# EAGLE design Pi-Can-Hat (EAGLE 7.4.0)

## Sheet 1 of 2
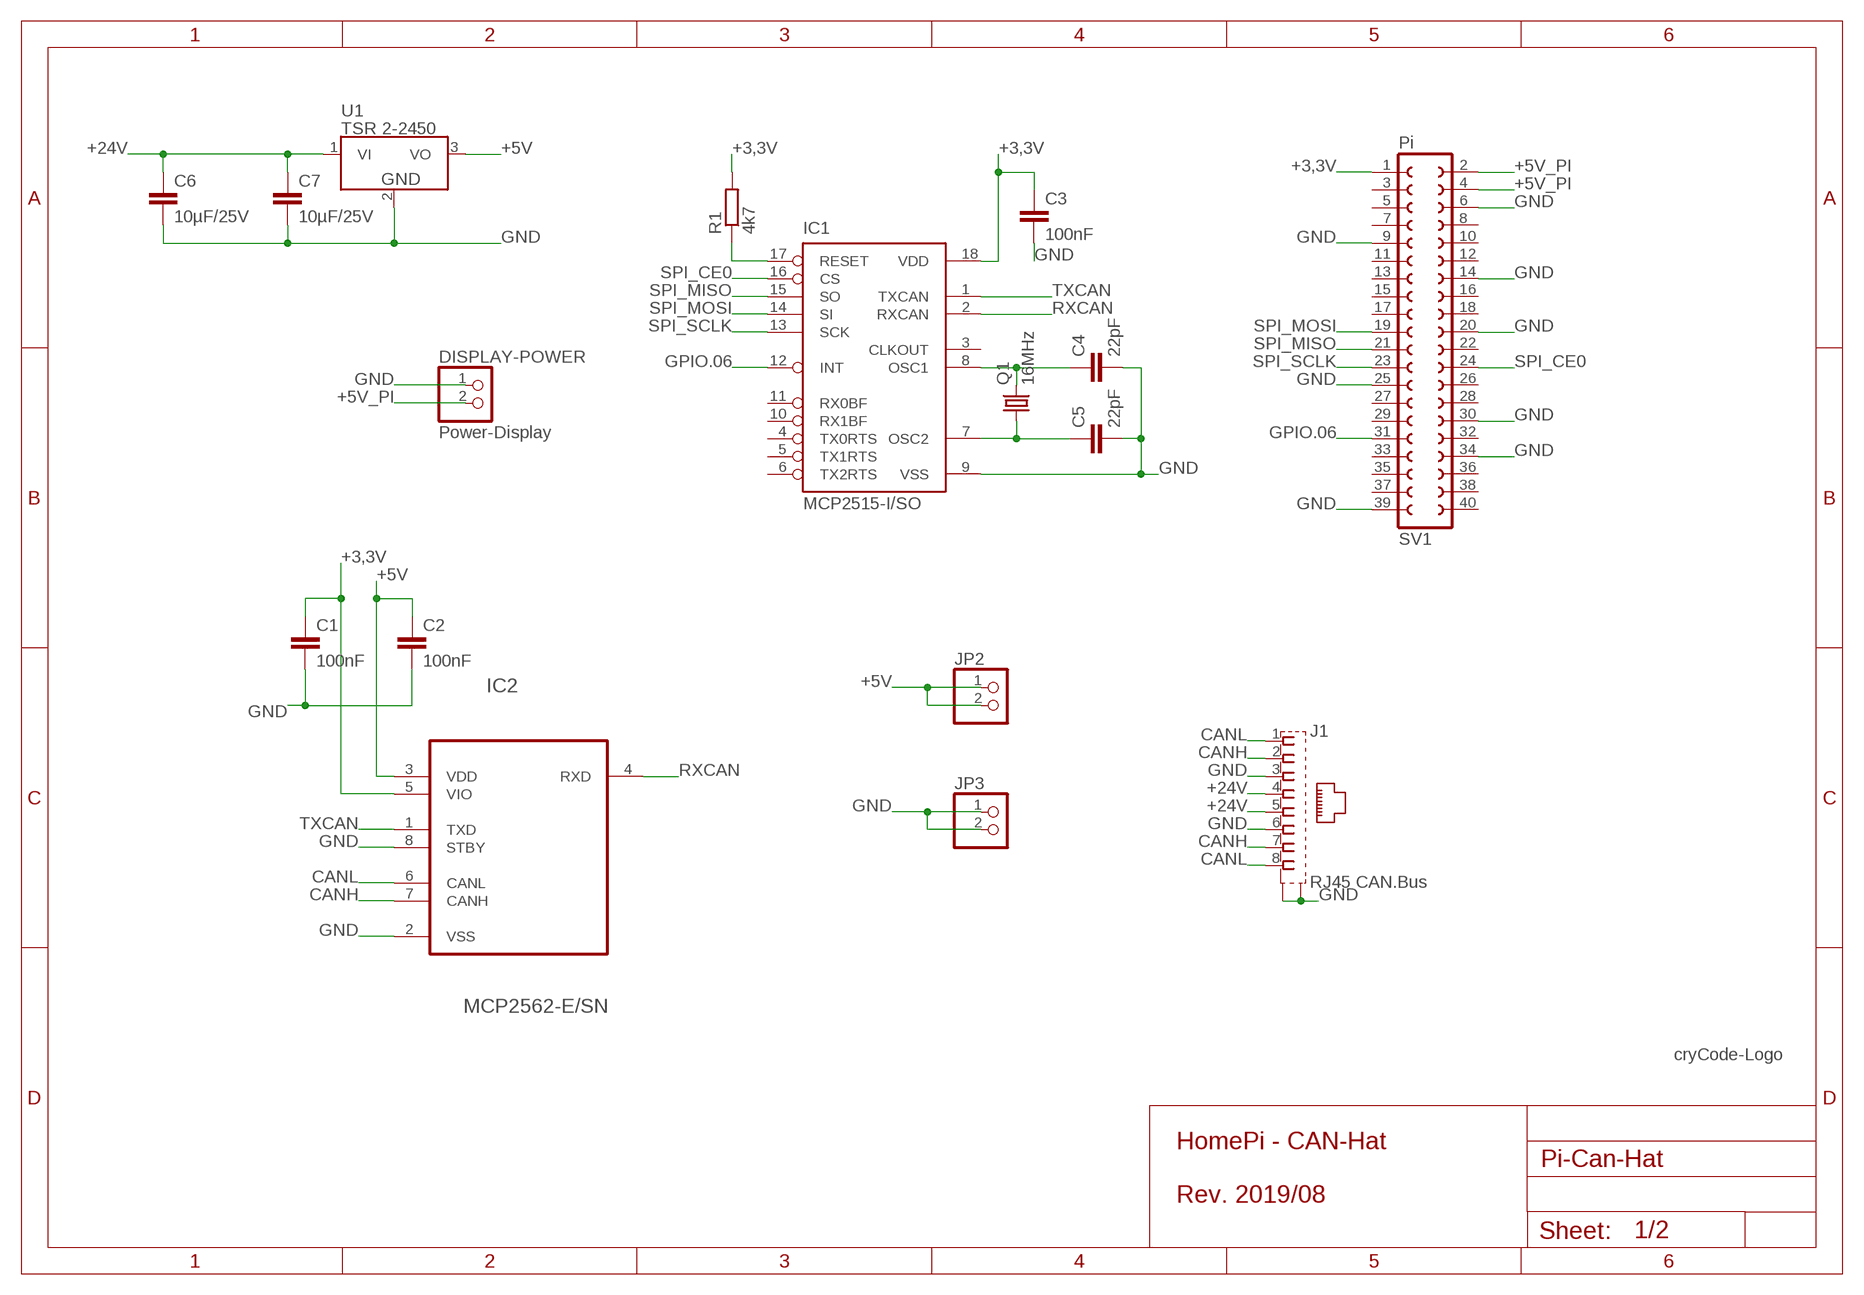
[diagram p0: schematic, sheet 1]

### Parts
C1  100nF  C-EUC1206  [C1206]
C2  100nF  C-EUC1206  [C1206]
C3  100nF  C-EUC1206  [C1206]
C4  22pF  C-EUC1206  [C1206]
C5  22pF  C-EUC1206  [C1206]
C6  10µF/25V  C-EUC1206  [C1206]
C7  10µF/25V  C-EUC1206  [C1206]
DISPLAY-POWER  Power-Display  PINHD-1X2/90  [1X02/90]
IC1  MCP2515-I/SO  [SO18L]
IC2  MCP2562-E/SN  [SO08]
J1  RJ45 CAN.Bus  555141-1  [MEBP_8-8G]
JP2  PINHD-1X2  [1X02]
JP3  PINHD-1X2  [1X02]
Q1  16MHz  CRYSTALHC49UP  [HC49UP]
R1  4k7  R-EU_R1206  [R1206]
SV1  Pi  FE20-2  [FE20-2]
U1  TSR 2-2450  TSR2-2450  [TSR2]
U$1  LOGO30MM  [30MM]

### Nets
+3,3V: C1.1 C3.1 IC1.18(VDD) IC2.5(VIO) R1.2 SV1.1
+5V: C2.1 IC2.3(VDD) JP2.1 JP2.2 U1.3(VO) ; also sheet 2
+5V_PI: DISPLAY-POWER.2 SV1.2 SV1.4 ; also sheet 2
+24V [24V]: C6.1 C7.1 J1.4 J1.5 U1.1(VI)
CANH: IC2.7(CANH) J1.2 J1.7 ; also sheet 2
CANL: IC2.6(CANL) J1.1 J1.8 ; also sheet 2
GND: C1.2 C2.2 C3.2 C4.2 C5.2 C6.2 C7.2 DISPLAY-POWER.1 IC1.9(VSS) IC2.2(VSS) IC2.8(STBY) J1.3 J1.6 J1.G1(S1) J1.G2(S2) JP3.1 JP3.2 SV1.6 SV1.9 SV1.14 SV1.20 SV1.25 SV1.30 SV1.34 SV1.39 U1.2(GND) ; also sheet 2
GPIO.06: IC1.12(INT) SV1.31
N$1: C4.1 IC1.8(OSC1) Q1.2
N$2: IC1.17(RESET) R1.1
N$4: C5.1 IC1.7(OSC2) Q1.1
RXCAN: IC1.2(RXCAN) IC2.4(RXD)
SPI_CE0: IC1.16(CS) SV1.24
SPI_MISO: IC1.15(SO) SV1.21
SPI_MOSI: IC1.14(SI) SV1.19
SPI_SCLK: IC1.13(SCK) SV1.23
TXCAN: IC1.1(TXCAN) IC2.1(TXD)
Unconnected: IC1.3(CLKOUT) IC1.4(TX0RTS) IC1.5(TX1RTS) IC1.6(TX2RTS) IC1.10(RX1BF) IC1.11(RX0BF) SV1.3 SV1.5 SV1.7 SV1.8 SV1.10 SV1.11 SV1.12 SV1.13 SV1.15 SV1.16 SV1.17 SV1.18 SV1.22 SV1.26 SV1.27 SV1.28 SV1.29 SV1.32 SV1.33 SV1.35 SV1.36 SV1.37 SV1.38 SV1.40

### Notes on the sheet
- HomePi - CAN-Hat
  
  Rev. 2019/08

## Sheet 2 of 2
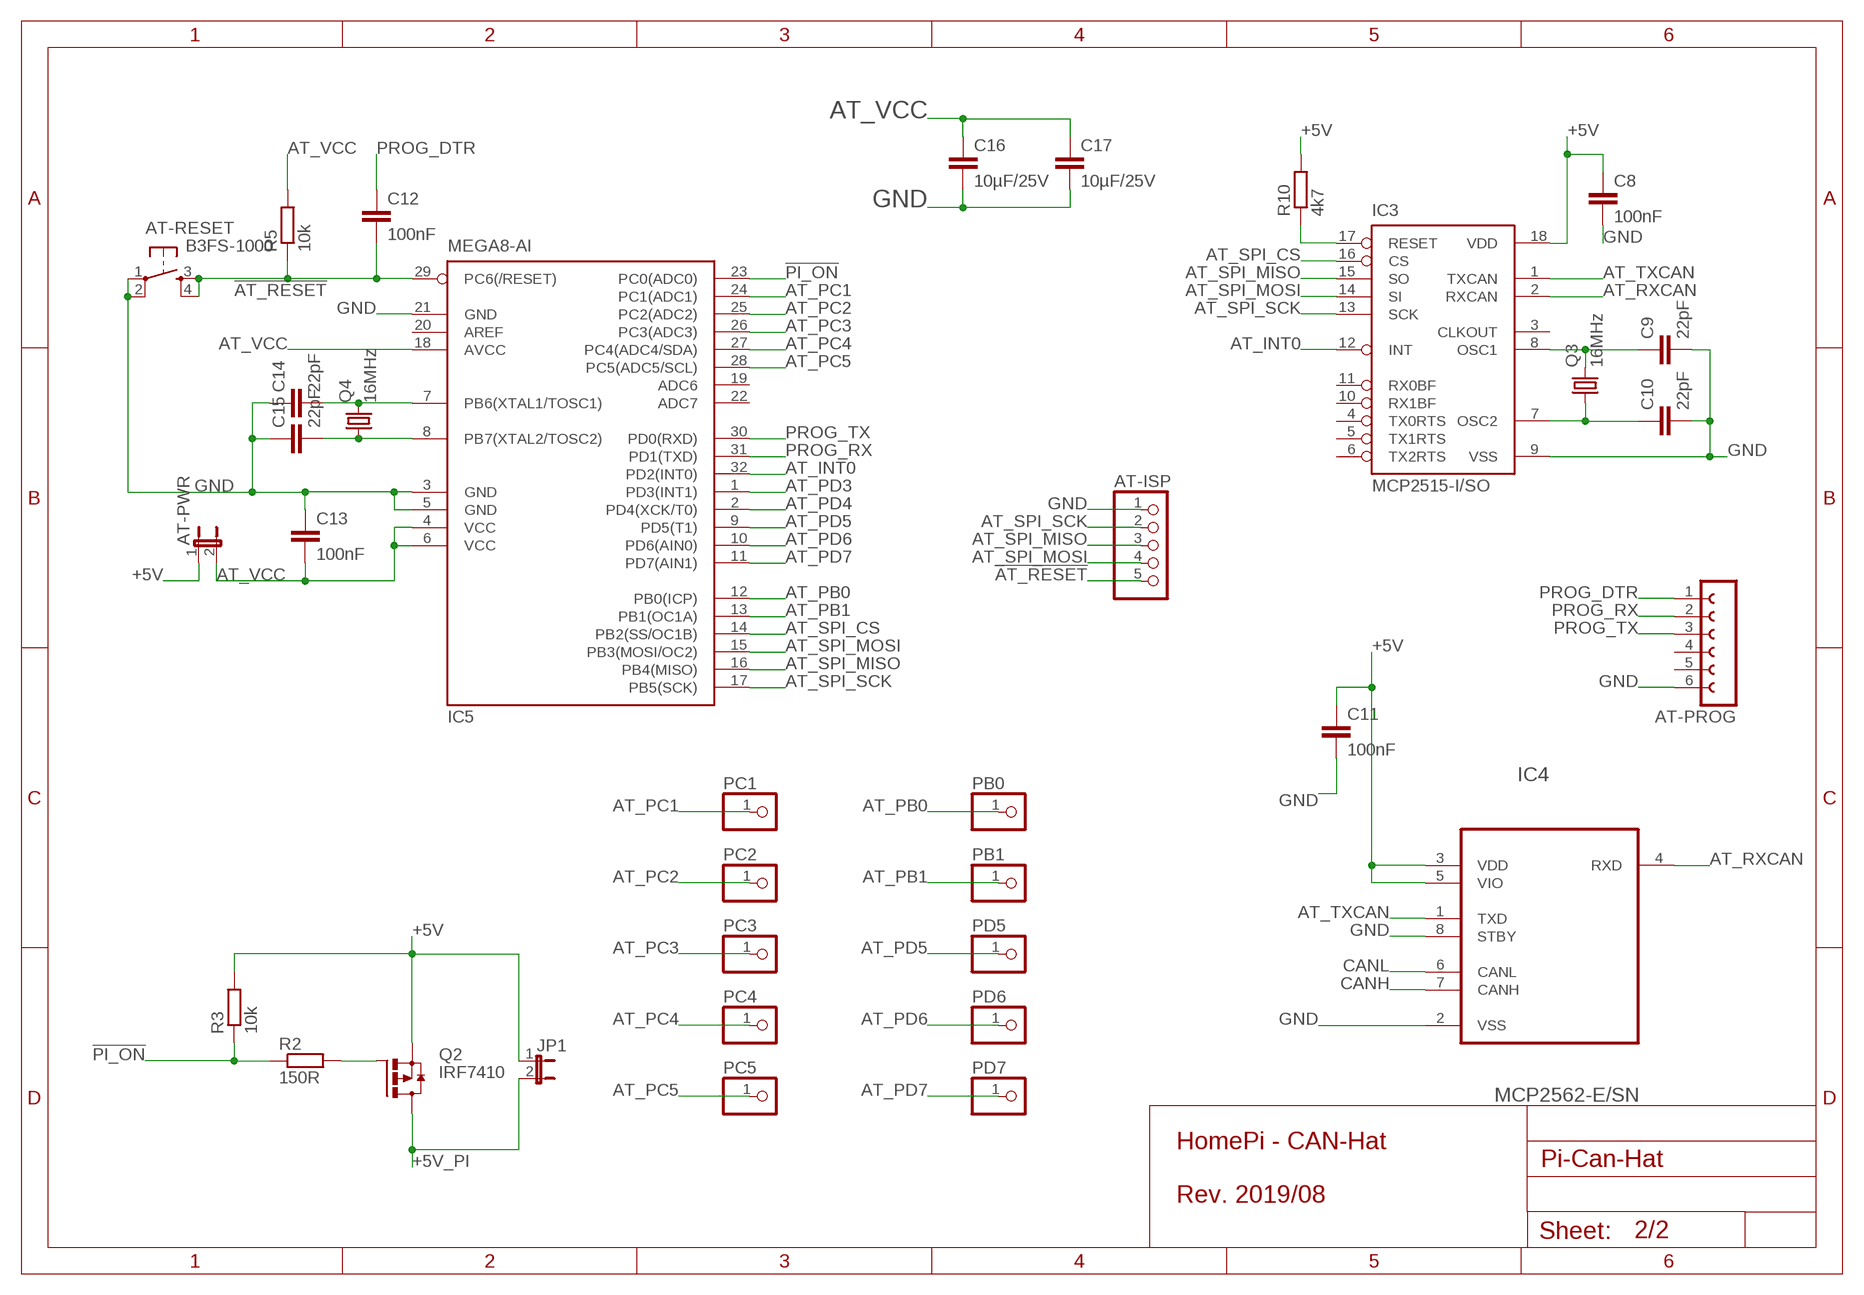
[diagram p1: schematic, sheet 2]

### Parts
AT-ISP  PINHD-1X5  [1X05]
AT-PROG  FE06W  [FE06W]
AT-PWR  JP1E  [JP1]
AT-RESET  B3FS-1000  [B3FS-1000]
C8  100nF  C-EUC1206  [C1206]
C9  22pF  C-EUC1206  [C1206]
C10  22pF  C-EUC1206  [C1206]
C11  100nF  C-EUC1206  [C1206]
C12  100nF  C-EUC1206  [C1206]
C13  100nF  C-EUC1206  [C1206]
C14  22pF  C-EUC1206  [C1206]
C15  22pF  C-EUC1206  [C1206]
C16  10µF/25V  C-EUC1206  [C1206]
C17  10µF/25V  C-EUC1206  [C1206]
IC3  MCP2515-I/SO  [SO18L]
IC4  MCP2562-E/SN  [SO08]
IC5  MEGA8-AI  [TQFP32-08]
JP1  JP1E  [JP1]
PB0  PINHD-1X1  [1X01]
PB1  PINHD-1X1  [1X01]
PC1  PINHD-1X1  [1X01]
PC2  PINHD-1X1  [1X01]
PC3  PINHD-1X1  [1X01]
PC4  PINHD-1X1  [1X01]
PC5  PINHD-1X1  [1X01]
PD5  PINHD-1X1  [1X01]
PD6  PINHD-1X1  [1X01]
PD7  PINHD-1X1  [1X01]
Q2  IRF7410  [SO08]
Q3  16MHz  CRYSTALHC49UP  [HC49UP]
Q4  16MHz  CRYSTALHC49UP  [HC49UP]
R2  150R  R-EU_R1206  [R1206]
R3  10k  R-EU_R1206  [R1206]
R5  10k  R-EU_R1206  [R1206]
R10  4k7  R-EU_R1206  [R1206]

### Nets
!AT_RESET: AT-ISP.5 AT-RESET.3(S) AT-RESET.4(S1) C12.2 IC5.29(PC6(/RESET)) R5.1
!PI_ON: IC5.23(PC0(ADC0)) R2.1 R3.1
+5V: AT-PWR.1 C8.1 C11.1 IC3.18(VDD) IC4.3(VDD) IC4.5(VIO) JP1.1 Q2.1(S) Q2.2(S) Q2.3(S) R3.2 R10.2 ; also sheet 1
+5V_PI: JP1.2 Q2.5(D) Q2.6(D) Q2.7(D) Q2.8(D) ; also sheet 1
AT_INT0: IC3.12(INT) IC5.32(PD2(INT0))
AT_PB0: IC5.12(PB0(ICP)) PB0.1
AT_PB1: IC5.13(PB1(OC1A)) PB1.1
AT_PC1: IC5.24(PC1(ADC1)) PC1.1
AT_PC2: IC5.25(PC2(ADC2)) PC2.1
AT_PC3: IC5.26(PC3(ADC3)) PC3.1
AT_PC4: IC5.27(PC4(ADC4/SDA)) PC4.1
AT_PC5: IC5.28(PC5(ADC5/SCL)) PC5.1
AT_PD3: IC5.1(PD3(INT1))
AT_PD4: IC5.2(PD4(XCK/T0))
AT_PD5: IC5.9(PD5(T1)) PD5.1
AT_PD6: IC5.10(PD6(AIN0)) PD6.1
AT_PD7: IC5.11(PD7(AIN1)) PD7.1
AT_RXCAN: IC3.2(RXCAN) IC4.4(RXD)
AT_SPI_CS: IC3.16(CS) IC5.14(PB2(SS/OC1B))
AT_SPI_MISO: AT-ISP.3 IC3.15(SO) IC5.16(PB4(MISO))
AT_SPI_MOSI: AT-ISP.4 IC3.14(SI) IC5.15(PB3(MOSI/OC2))
AT_SPI_SCK: AT-ISP.2 IC3.13(SCK) IC5.17(PB5(SCK))
AT_TXCAN: IC3.1(TXCAN) IC4.1(TXD)
AT_VCC: AT-PWR.2 C13.2 C16.1 C17.1 IC5.4(VCC) IC5.6(VCC) IC5.18(AVCC) R5.2
CANH: IC4.7(CANH) ; also sheet 1
CANL: IC4.6(CANL) ; also sheet 1
GND: AT-ISP.1 AT-PROG.6 AT-RESET.1(P) AT-RESET.2(P1) C8.2 C9.2 C10.2 C11.2 C13.1 C14.1 C15.1 C16.2 C17.2 IC3.9(VSS) IC4.2(VSS) IC4.8(STBY) IC5.3(GND) IC5.5(GND) IC5.21(GND) ; also sheet 1
N$5: Q2.4(G) R2.2
N$6: IC3.17(RESET) R10.1
N$7: C9.1 IC3.8(OSC1) Q3.2
N$8: C10.1 IC3.7(OSC2) Q3.1
N$10: C14.2 IC5.7(PB6(XTAL1/TOSC1)) Q4.2
N$11: C15.2 IC5.8(PB7(XTAL2/TOSC2)) Q4.1
PROG_DTR: AT-PROG.1 C12.1
PROG_RX: AT-PROG.2 IC5.31(PD1(TXD))
PROG_TX: AT-PROG.3 IC5.30(PD0(RXD))
Unconnected: AT-PROG.4 AT-PROG.5 IC3.3(CLKOUT) IC3.4(TX0RTS) IC3.5(TX1RTS) IC3.6(TX2RTS) IC3.10(RX1BF) IC3.11(RX0BF) IC5.19(ADC6) IC5.20(AREF) IC5.22(ADC7)

### Notes on the sheet
- HomePi - CAN-Hat
  
  Rev. 2019/08

## Library data of the parts
AT-ISP = pinhead:PINHD-1X5: PIN HEADER
AT-PROG = con-lsta:FE06W: FEMALE HEADER; OC_FARNELL: unknown; OC_NEWARK: unknown
AT-PWR JP1 = jumper:JP1E: JUMPER
AT-RESET = b3fs-1000:B3FS-1000
C1-C17 = rcl:C-EU: CAPACITOR, European symbol
DISPLAY-POWER JP2 JP3 = pinhead:PINHD-1X2: PIN HEADER
IC1 IC3 = mcp2515_2551_2562:MCP2515
IC2 IC4 = mcp2515_2551_2562:MCP2562: High-Speed CAN Transceiver,DIP-8
IC5 = atmel:MEGA8: MICROCONTROLLER 8 Kbytes FLASH, 1 kbytes SRAM, 512 bytes EEPROM, USART, 6-channel 10 bit ADC, 2-channel 8 bit ADC Pin compatible with Atmega48, ATMega88, ATMega168 Source: avr.lbr; MPN: ATMEGA8-16AU; OC_FARNELL: 9171371; OC_NEWARK: 73M8863
J1 = mebp_8-8g:555141-1: AMP connector Reichelt Bestell-Nr. MEBP 8-8G
PB0 PB1 PC1-PC5 PD5-PD7 = pinhead:PINHD-1X1: PIN HEADER
Q1 Q3 Q4 = crystal:CRYSTAL: CRYSTAL; OC_FARNELL: unknown; OC_NEWARK: unknown
Q2 = IRF74:IRF7410: HEXFET Power MOSFET P-Channel MOSFET VDS = -12V ID@25°C = -16A ID@70°C = -13A RDS@VGS=-4.5V,ID=-16A = 0.007 Ohm RDS@VGS=-2.5V,ID=-13.6A = 0.009 Ohm RDS@VGS=-1.8V,ID=-11.5A = 0.013 Ohm
R1-R3 R5 R10 = rcl:R-EU_: RESISTOR, European symbol
SV1 = con-lsta:FE20-2: FEMALE HEADER; OC_FARNELL: unknown; OC_NEWARK: unknown
U1 = TSR:TSR2-*: TSR 2 Series, 1 A The new TSR 2 series step-down switching regulators are drop-in replacement for inefficient LMxx linear regulators. A high efficiency up to 96 % allows full load operation up to +67°C ambient temperature without the need of any heat-sink or forced cooling.The TSR 2 switching regulators provide other significant features over linear regulators, i.e. better output accuracy (±2 %), lower standby current of 2 mA and no requirement of external capacitors. The high efficiency and low standby power consumption makes these regulators an ideal solution for many battery powered applications.
U$1 = cryCode-Logo:LOGO

## Net classes
1 24V: width 0.813 mm, clearance 0.406 mm

## Board
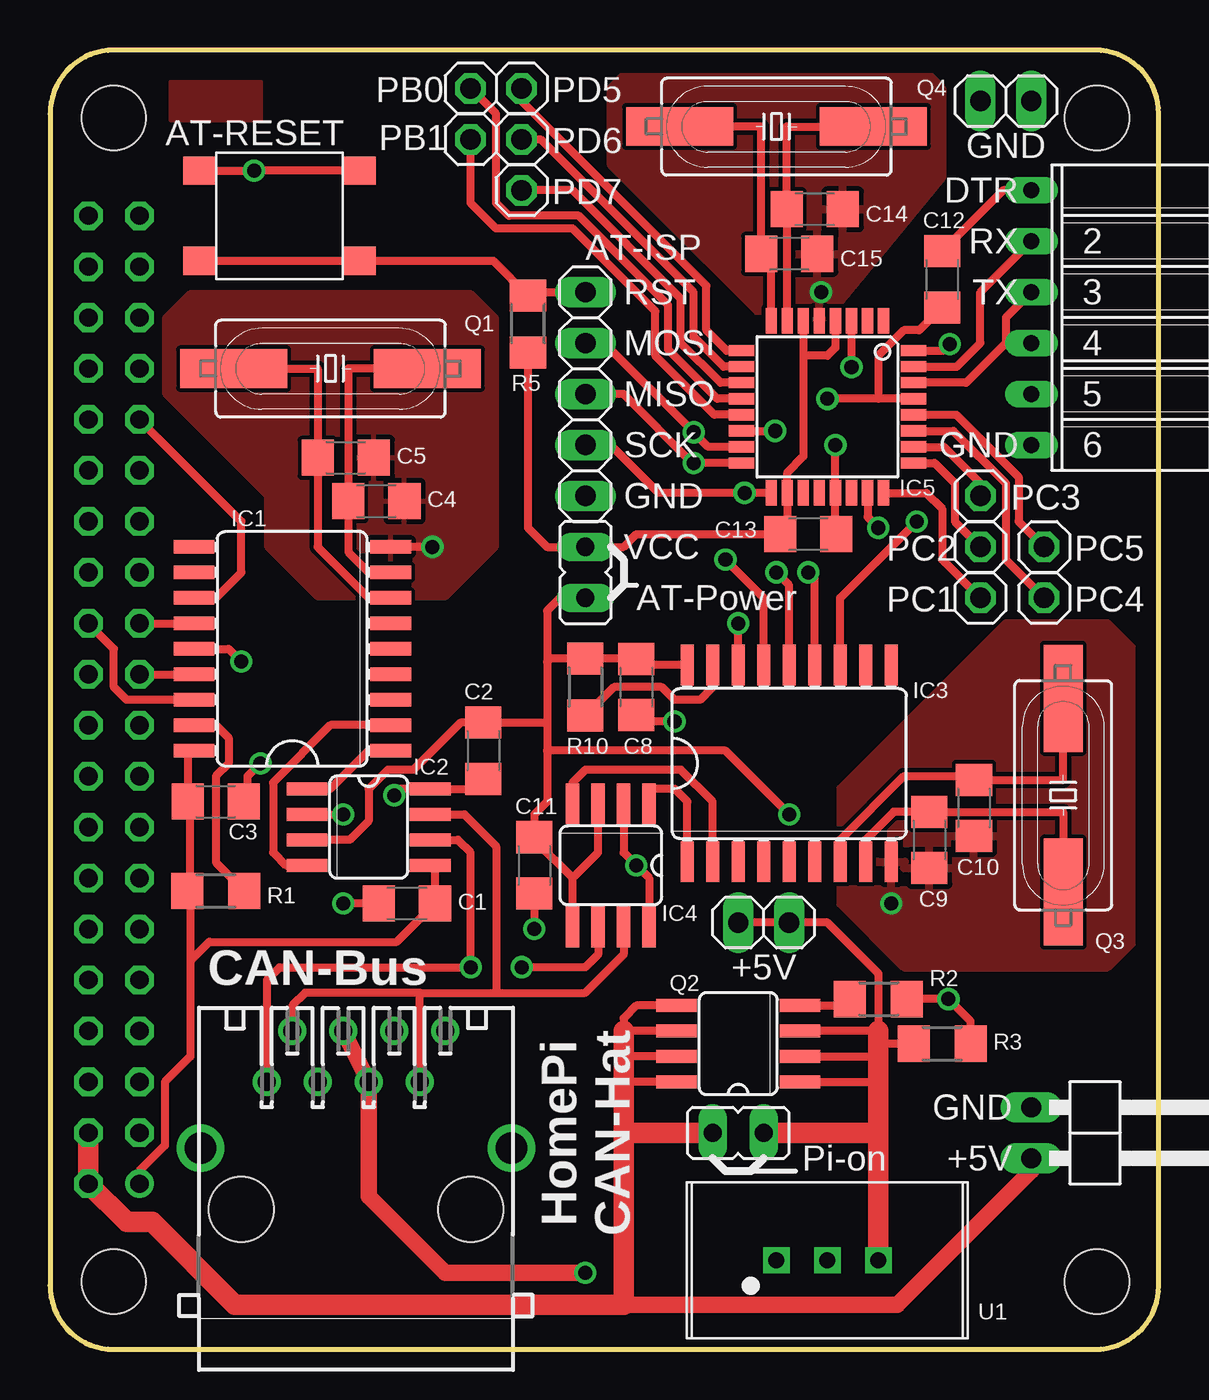
[diagram p2: board, top side]
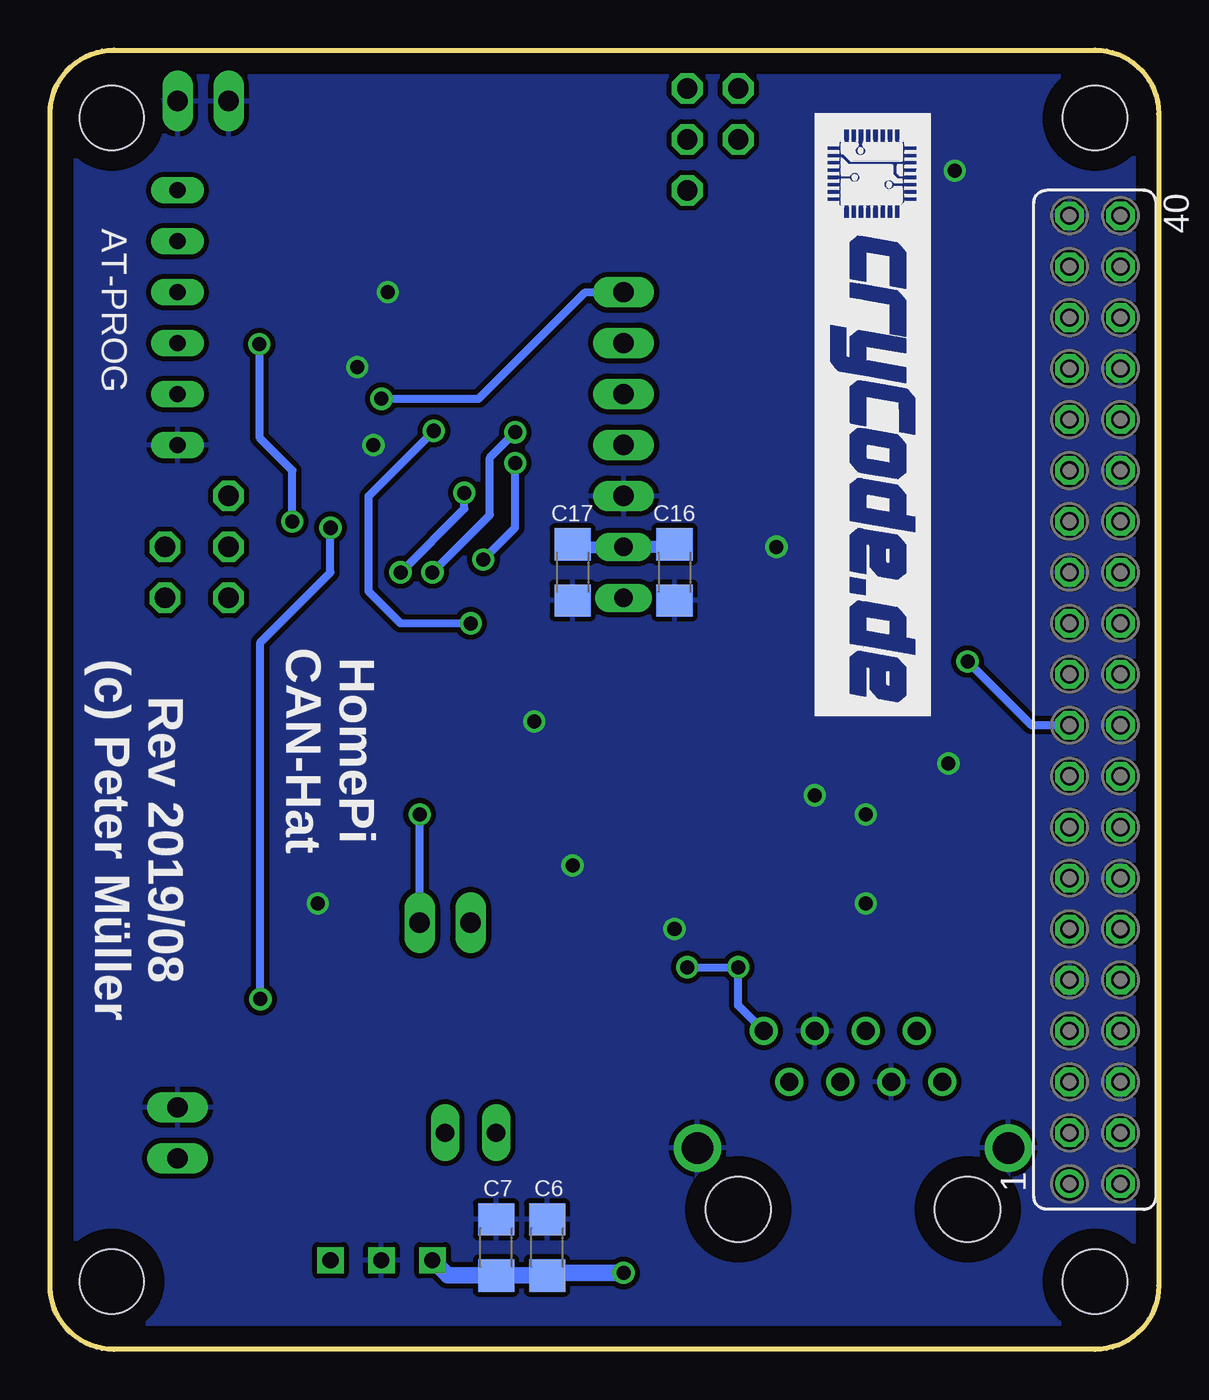
[diagram p3: board, bottom side, seen from below]

Size 55.24 x 64.77 mm. Coordinates in mm from the lower left corner, seen from the top.
Outline: 0,3.17 arc90 3.17,0 52.07,0 arc90 55.24,3.17 55.24,61.59 arc90 52.07,64.77 3.17,64.77 arc90 0,61.59 0,3.17
Copper layers (1*16): Top 0.035mm / dielectric 1.5mm / Bottom 0.035mm
Design rules "allpcb2 *": minimum track width 8mil, minimum drill 0.5mm, track to track 8mil, track to pad 8mil, pad to pad 8mil, via to via 8mil, smd to smd 6mil, copper to edge 40mil, drill to drill 8mil, minimum pad ring 10mil, minimum via ring 8mil, stop-mask expansion 0.1mm, vias tented up to drill 0mil, thermal gap 10mil
Holes 3.2 mm at 3.17,3.38 3.17,61.38 52.17,3.38 52.17,61.38

### Footprints (pad centres in the part's own frame; a part is rotated, then mirrored left to right if it is on the bottom)
1X05 = drill 1.016 long: 1 -5.08,0; 2 -2.54,0; 3 0,0; 4 2.54,0; 5 5.08,0
FE06W = drill 0.813 long: 1 -6.35,0; 2 -3.81,0; 3 -1.27,0; 4 1.27,0; 5 3.81,0; 6 6.35,0
JP1 = drill 0.914 long: 1 0,-1.27; 2 0,1.27
B3FS-1000 = smd 1.6 x 1.4: 1 4,-2.25; 2 -4,-2.25; 3 4,2.25; 4 -4,2.25
C1206 = smd 1.6 x 1.8: 1 -1.4,0; 2 1.4,0
1X02/90 = drill 1.016 long: 1 -1.27,-3.81; 2 1.27,-3.81
SO18L = smd 0.66 x 2.032: 1 -5.08,-4.902; 2 -3.81,-4.902; 3 -2.54,-4.902; 4 -1.27,-4.902; 5 0,-4.902; 6 1.27,-4.902; 7 2.54,-4.902; 8 3.81,-4.902; 9 5.08,-4.902; 10 5.08,4.902; 11 3.81,4.902; 12 2.54,4.902; 13 1.27,4.902; 14 0,4.902; 15 -1.27,4.902; 16 -2.54,4.902; 17 -3.81,4.902; 18 -5.08,4.902
SO08 = smd 0.66 x 2.032: 1 -1.905,-3.073; 2 -0.635,-3.073; 3 0.635,-3.073; 4 1.905,-3.073; 5 1.905,3.073; 6 0.635,3.073; 7 -0.635,3.073; 8 -1.905,3.073
TQFP32-08 = smd 1.27 x 0.559: 1 -4.293,2.8; 2 -4.293,2; 3 -4.293,1.2; 4 -4.293,0.4; 5 -4.293,-0.4; 6 -4.293,-1.2; 7 -4.293,-2; 8 -4.293,-2.8; 17 4.293,-2.8; 18 4.293,-2; 19 4.293,-1.2; 20 4.293,-0.4; 21 4.293,0.4; 22 4.293,1.2; 23 4.293,2; 24 4.293,2.8 | smd 0.559 x 1.27: 9 -2.8,-4.293; 10 -2,-4.293; 11 -1.2,-4.293; 12 -0.4,-4.293; 13 0.4,-4.293; 14 1.2,-4.293; 15 2,-4.293; 16 2.8,-4.293; 25 2.8,4.293; 26 2,4.293; 27 1.2,4.293; 28 0.4,4.293; 29 -0.4,4.293; 30 -1.2,4.293; 31 -2,4.293; 32 -2.8,4.293
MEBP_8-8G = drill 0.889: 1 -4.445,6.35; 2 -3.175,8.89; 3 -1.905,6.35; 4 -0.635,8.89; 5 0.635,6.35; 6 1.905,8.89; 7 3.175,6.35; 8 4.445,8.89 | drill 1.575 pad 2.184: G1 -7.745,3.05; G2 7.745,3.05 | hole 3.251: -5.715,0; 5.715,0
1X02 = drill 1.016 long: 1 -1.27,0; 2 1.27,0
1X01 = drill 1.016 octagon: 1 0,0
HC49UP = smd 5.334 x 1.93: 1 -4.826,0; 2 4.826,0
R1206 = smd 1.6 x 1.803: 1 -1.422,0; 2 1.422,0
FE20-2 = drill 0.914: 1 -24.13,1.27 | drill 0.914 octagon: 2 -24.13,-1.27; 3 -21.59,1.27; 4 -21.59,-1.27; 5 -19.05,1.27; 6 -19.05,-1.27; 7 -16.51,1.27; 8 -16.51,-1.27; 9 -13.97,1.27; 10 -13.97,-1.27; 11 -11.43,1.27; 12 -11.43,-1.27; 13 -8.89,1.27; 14 -8.89,-1.27; 15 -6.35,1.27; 16 -6.35,-1.27; 17 -3.81,1.27; 18 -3.81,-1.27; 19 -1.27,1.27; 20 -1.27,-1.27; 21 1.27,1.27; 22 1.27,-1.27; 23 3.81,1.27; 24 3.81,-1.27; 25 6.35,1.27; 26 6.35,-1.27; 27 8.89,1.27; 28 8.89,-1.27; 29 11.43,1.27; 30 11.43,-1.27; 31 13.97,1.27; 32 13.97,-1.27; 33 16.51,1.27; 34 16.51,-1.27; 35 19.05,1.27; 36 19.05,-1.27; 37 21.59,1.27; 38 21.59,-1.27; 39 24.13,1.27; 40 24.13,-1.27
TSR2 = drill 0.8 square: 1 -2.54,0; 2 0,0; 3 2.54,0

### Placement (x,y rotation side)
AT-ISP  26.67,47.62 90 top
AT-PROG  48.9,51.44 270 top
AT-PWR  26.67,38.73 0 top
AT-RESET  11.43,56.52 180 top
C1  17.78,22.23 180 top
C2  21.59,29.84 270 top
C3  8.26,27.3 0 top
C4  16.26,42.29 0 top
C5  14.73,44.45 0 top
C6  30.48,5.08 90 bottom
C7  33.02,5.08 90 bottom
C8  29.21,33.02 270 top
C9  43.81,25.4 270 top
C10  46.04,26.99 270 top
C11  24.13,24.13 270 top
C12  44.45,53.34 270 top
C13  37.78,40.64 180 top
C14  38.1,56.83 180 top
C15  36.83,54.61 180 top
C16  24.13,38.73 270 bottom
C17  29.21,38.73 270 bottom
DISPLAY-POWER  52.7,10.79 270 top
IC1  12.06,34.92 90 top
IC2  15.88,26.04 270 top
IC3  36.83,29.21 0 top
IC4  27.94,24.13 180 top
IC5  38.73,46.99 270 top
J1  15.24,6.99 0 top
JP1  34.29,10.79 90 top
JP2  35.56,21.27 180 top
JP3  47.62,62.23 0 top
PB0  20.95,62.87 0 top
PB1  20.95,60.33 0 top
PC1  46.35,37.47 0 top
PC2  46.35,40.01 0 top
PC3  46.35,42.55 0 top
PC4  49.53,37.47 0 top
PC5  49.53,40.01 0 top
PD5  23.5,62.87 0 top
PD6  23.5,60.33 0 top
PD7  23.5,57.78 0 top
Q1  13.97,48.9 0 top
Q2  34.29,15.24 90 top
Q3  50.48,27.62 270 top
Q4  36.2,60.96 0 top
R1  8.26,22.86 180 top
R2  41.27,17.46 180 top
R3  44.45,15.24 180 top
R5  23.81,51.12 270 top
R10  26.67,33.02 90 top
SV1  3.17,32.38 90 bottom
U1  38.73,4.45 0 top
U$1  17.14,61.59 270 bottom

### Tracks (layer width: path | path; a pad name or v marks a point on that pad's centre or on a via)
!AT_RESET  (via drill 0.7)
  Top 0.406: IC5.29 41.27,47.39 | 41.27,47.39 v38.73,47.39 | 41.27,47.39 41.27,49.53 42.55,50.8 43.31,50.8 C12.2 | AT-RESET.3 AT-RESET.4 22.09,54.27 R5.1 23.98,52.7 AT-ISP.5
  Bottom 0.406: v38.73,47.39 33.89,47.39 28.57,52.7 AT-ISP.5
!PI_ON  (via drill 0.7)
  Top 0.406: IC5.23 40.73,41.5 v41.27,40.96 | R2.1 v44.77,17.46 45.87,16.36 R3.1
  Bottom 0.406: v44.77,17.46 44.77,35.24 41.27,38.73 v41.27,40.96
+3,3V
  Top 0.406: IC1.18 6.86,29.84 C3.1 6.99,27.3 6.99,23.5 | SV1.1 4.45,8.89 5.71,10.16 5.71,13.34 6.99,14.61 6.99,19.37 | 6.99,23.5 6.99,19.37 | IC2.5 19.18,24.13 C1.1 17.27,20.32 7.94,20.32 6.99,19.37 | 6.99,23.5 R1.2
+5V  (via drill 0.7)
  Top 0.406: Q2.3 41.27,15.88 41.27,18.73 38.73,21.27 JP2.1 JP2.2 | Q2.2 41.27,14.61 | Q2.1 41.27,13.34 | IC4.5 26.04,23.5 | 26.04,23.5 27.3,24.77 IC4.3 | IC3.18 29.54,34.11 C8.1 29.19,34.44 R10.2 24.92,34.44 24.77,34.29 | AT-PWR.1 25.4,37.47 24.77,36.83 24.77,34.29 | 24.77,34.29 24.77,31.11 | 24.77,31.11 24.64,31.25 C2.1 20.45,31.25 18.1,28.89 16.83,28.89 15.88,27.94 15.88,26.35 14.92,25.4 IC2.3 | R3.2 41.27,15.24 | 24.77,31.11 24.77,29.84 | 24.77,29.84 24.77,27.3 24.13,26.67 C11.1 24.13,25.4 26.04,23.5 | 24.77,29.84 33.66,29.84 v36.83,26.67
  Top 1.016: 41.27,15.88 41.27,15.24 41.27,14.61 41.27,13.34 41.27,10.79 | U1.3 41.27,10.79 | JP1.1 41.27,10.79
  Bottom 0.406: JP2.1 v36.83,26.67
+5V_PI
  Top 0.406: Q2.6 28.57,15.88 28.57,16.51 29.21,17.14 Q2.5 | Q2.7 28.57,14.61 | Q2.8 28.57,13.34
  Top 0.813: 28.57,2.22 42.23,2.22 48.9,8.89 DISPLAY-POWER.2
  Top 1.016: 28.57,15.88 28.57,14.61 28.57,13.34 28.57,10.79 | SV1.4 SV1.2 3.81,6.35 5.08,6.35 9.21,2.22 28.57,2.22 28.57,10.79 | JP1.2 28.57,10.79
+24V  (via drill 0.7)
  Top 0.813: J1.4 J1.5 15.88,7.62 19.68,3.81 v26.67,3.81
  Bottom 0.813: U1.1 35.43,3.68 C7.1 C6.1 29.71,3.81 v26.67,3.81
AT_INT0  (via drill 0.7)
  Top 0.406: IC3.12 39.37,37.47 v43.18,41.27 | IC5.32 44.51,49.79 v44.83,50.11
  Bottom 0.406: v43.18,41.27 43.18,43.81 44.83,45.46 v44.83,50.11
AT_PB0
  Top 0.406: IC5.12 33.26,47.39 30.8,49.85 30.8,52.07 26.35,56.52 22.86,56.52 22.23,57.15 22.23,61.59 PB0.1
AT_PB1
  Top 0.406: IC5.13 33.1,46.59 30.16,49.53 30.16,51.75 26.04,55.88 22.23,55.88 20.95,57.15 PB1.1
AT_PC1
  Top 0.406: IC5.24 43.66,42.7 44.45,41.91 44.45,39.37 PC1.1
AT_PC2
  Top 0.406: IC5.25 44.08,44.19 45.09,43.18 45.09,41.27 PC2.1
AT_PC3
  Top 0.406: IC5.26 44.55,44.99 46.35,43.18 PC3.1
AT_PC4
  Top 0.406: IC5.27 45.02,45.79 47.62,43.18 47.62,39.37 PC4.1
AT_PC5
  Top 0.406: IC5.28 45.17,46.59 48.26,43.5 48.26,41.27 PC5.1
AT_PD5
  Top 0.406: IC5.9 33.71,49.79 32.7,50.8 32.7,53.02 23.5,62.23 PD5.1
AT_PD6
  Top 0.406: IC5.10 33.56,48.99 32.07,50.48 32.07,52.7 24.45,60.33 PD6.1
AT_PD7
  Top 0.406: IC5.11 33.41,48.19 31.43,50.16 31.43,52.39 26.04,57.78 PD7.1
AT_RXCAN
  Top 0.406: IC3.2 33.02,27.3 31.43,28.89 26.67,28.89 26.04,28.26 IC4.4
AT_SPI_CS  (via drill 0.7)
  Top 0.406: IC3.16 v34.29,36.2 | IC5.14 v36.12,45.79
  Bottom 0.406: v34.29,36.2 37.78,36.2 39.37,37.78 39.37,42.55 v36.12,45.79
AT_SPI_MISO  (via drill 0.7)
  Top 0.406: IC5.16 v32.07,44.19 32.01,44.19 28.57,47.62 AT-ISP.3 | IC3.15 35.56,37.47 v33.66,39.37
  Bottom 0.406: v32.07,44.19 32.07,40.96 v33.66,39.37
AT_SPI_MOSI  (via drill 0.7)
  Top 0.406: 27.94,50.16 27.62,50.16 | 27.62,50.16 AT-ISP.4 | IC3.14 36.83,38.1 v36.2,38.73 | IC5.15 32.8,44.99 v32.07,45.72 27.62,50.16
  Bottom 0.406: v32.07,45.72 33.34,44.45 33.34,41.59 v36.2,38.73
AT_SPI_SCK  (via drill 0.7)
  Top 0.406: IC5.17 v34.61,42.7 30.33,42.7 27.94,45.09 AT-ISP.2 | IC3.13 38.1,38.42 v37.78,38.73
  Bottom 0.406: v37.78,38.73 34.61,41.91 v34.61,42.7
AT_TXCAN
  Top 0.406: IC3.1 31.75,27.3 31.11,27.94 29.84,27.94 IC4.1
AT_VCC
  Top 0.406: IC5.6 37.53,49.53 | 37.53,49.53 37.53,44.52 36.73,43.72 IC5.18 36.73,40.67 C13.2 29.21,40.64 28.57,40.01 AT-PWR.2 24.77,40.01 23.81,40.96 R5.2 | IC5.4 39.13,49.93 38.73,49.53 37.53,49.53
  Bottom 0.61: C16.1 24.13,40.01 AT-PWR.2 29.21,40.01 C17.1
CANH
  Top 0.406: J1.2 12.06,17.14 12.7,17.78 18.41,17.78 | IC2.7 20.64,26.67 22.23,25.08 22.23,17.78 | J1.7 18.41,17.78 | IC4.7 28.57,19.68 26.67,17.78 22.23,17.78 | 18.41,17.78 22.23,17.78
CANL  (via drill 0.7)
  Top 0.406: J1.1 10.79,18.41 11.43,19.05 v20.95,19.05 20.95,24.77 20.32,25.4 IC2.6 | IC4.6 27.3,19.68 26.67,19.05 v23.5,19.05
  Bottom 0.406: J1.8 20.95,17.14 v20.95,19.05 v23.5,19.05
GND  (via drill 0.7)
  Top 0.406: v19.05,40.01 IC1.9 | IC2.2 v14.61,26.67 | C1.2 v14.61,22.23 | v17.14,27.62 17.46,27.94 IC2.8 21.09,27.94 C2.2 | v10.48,29.21 9.84,28.57 9.84,27.49 C3.2 | IC4.2 28.57,24.77 v29.21,24.13 29.84,23.5 IC4.8 | IC5.3 v39.94,48.97 | v39.13,45.09 IC5.21 39.13,41.01 C13.1 | AT-RESET.1 v10.16,58.77 AT-RESET.2 | C11.2 v24.13,20.95 | v31.11,31.3 29.53,31.3 C8.2
  other vias: 41.91,22.23 38.42,52.7
  pour Bottom (isolate 0.254): 0.64,3.17 arc90 3.17,0.64 52.07,0.64 arc90 54.61,3.17 54.61,61.59 arc90 52.07,64.14 3.17,64.14 arc90 0.64,61.59
  pour Top: 5.71,51.44 6.99,52.7 20.95,52.7 22.23,51.44 22.23,40.01 19.68,37.47 13.34,37.47 10.79,40.01 10.79,42.55 5.71,47.62
  pour Top: 39.37,22.23 42.55,19.05 52.7,19.05 53.98,20.32 53.98,34.92 52.7,36.2 47.62,36.2 39.37,27.94
  pour Top: 38.73,51.44 35.56,51.44 27.94,59.05 27.94,62.87 29.21,64.14 43.18,64.14 44.45,62.87 44.45,58.42
  pour Bottom: 6.03,63.18 10.48,63.18 10.48,61.28 6.03,61.28
GPIO.06
  Top 0.406: IC1.12 8.26,37.47 9.53,38.73 9.53,41.27 SV1.31
N$1
  Top 0.406: Q1.2 14.86,48.9 C4.1 14.86,39.75 15.88,38.73 IC1.8
N$2
  Top 0.406: IC1.17 8.26,31.11 8.89,30.48 8.89,29.21 8.26,28.57 8.26,24.28 R1.1
N$4
  Top 0.406: Q1.1 13.33,48.9 C5.1 13.33,40.01 15.88,37.47 IC1.7
N$5
  Top 0.406: Q2.4 39.53,17.14 R2.2
N$6
  Top 0.406: IC3.17 33.02,33.02 32.38,32.38 31.11,32.38 30.48,33.02 28.09,33.02 R10.1
N$7
  Top 0.406: IC3.8 40.64,25.4 42.04,26.8 C9.1 50.48,26.8 Q3.2
N$8
  Top 0.406: IC3.7 39.37,25.4 42.55,28.57 45.85,28.57 C10.1 50.48,28.39 Q3.1 50.8,32.38
N$10
  Top 0.406: Q4.2 36.7,60.96 C14.2 36.73,56.52 IC5.7
N$11
  Top 0.406: IC5.8 35.94,54.1 C15.2 35.43,60.96 Q4.1
PROG_DTR
  Top 0.406: AT-PROG.1 47.49,57.78 C12.1
PROG_RX
  Top 0.406: IC5.31 45.18,48.99 46.35,50.16 46.35,52.7 AT-PROG.2
PROG_TX
  Top 0.406: AT-PROG.3 47.62,51.44 47.62,50.16 45.65,48.19 IC5.30
RXCAN
  Top 0.406: IC1.2 13.97,31.11 11.11,28.26 11.11,24.77 11.75,24.13 IC2.4
SPI_CE0
  Top 0.406: IC1.16 3.81,32.38 3.17,33.02 3.17,34.92 SV1.24
SPI_MISO
  Top 0.406: SV1.21 IC1.15
SPI_MOSI  (via drill 0.7)
  Top 0.406: IC1.14 8.89,34.92 v9.53,34.29
  Bottom 0.406: v9.53,34.29 6.35,31.11 SV1.19
SPI_SCLK
  Top 0.406: SV1.23 IC1.13
TOP
  pour Top: 6.03,63.18 10.48,63.18 10.48,61.28 6.03,61.28
TXCAN
  Top 0.406: IC1.1 15.88,29.84 13.97,27.94 IC2.1

### Text on the board
tNames: GND | DTR | RX | AT-ISP | TX | RST | MOSI | MISO | GND | SCK | GND | VCC | AT-Power | +5V | CAN-Bus | HomePi / CAN-Hat | GND | +5V | Pi-on
bNames: HomePi / CAN-Hat | Rev 2019/08 / (c) Peter Müller
tRestrict: TOP
bRestrict: BOT